# Altium schematic sheet signal_adaptation_block_Tine.SchDoc
size A4; SheetNumber: 4; SheetTotal: 4; SPICEModelCacheXXBIXYNA: <root> / <DocumentId>XXBIXYNA</DocumentId> / </root>
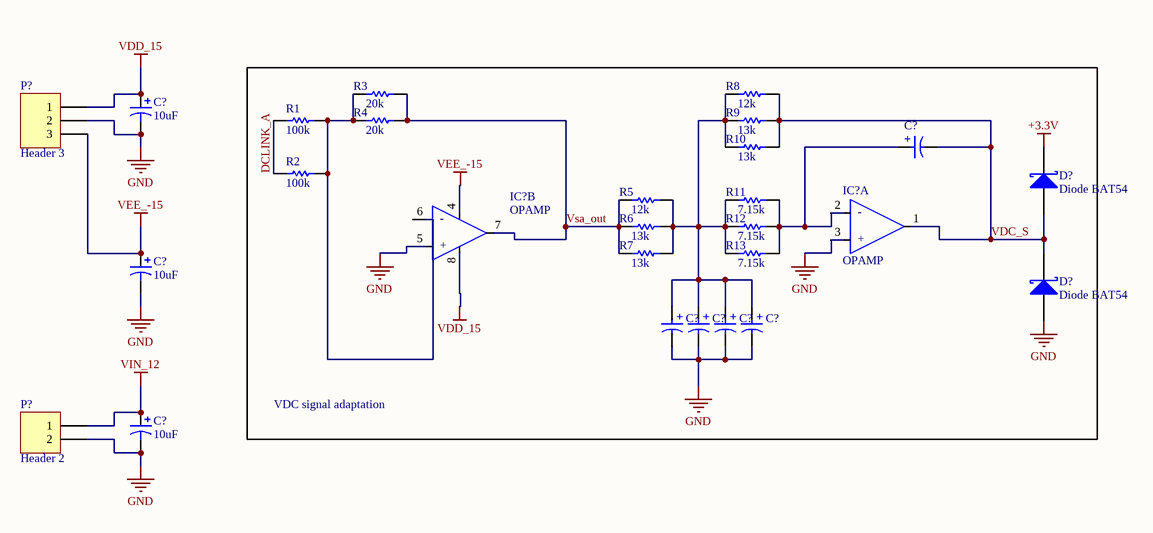
[diagram p0: signal_adaptation_block_Tine.SchDoc]

## Parts
(Parts that share a designator on the sheet are numbered #1, #2 ... from top to bottom, then left to right.)
C?#1  value 10uF  [RAD-0.2]  (hidden comment: Cap Pol1)
C?#2  860020772005  [WCAP-ATG5_D5H11]  (value not drawn)
C?#3  value 10uF  [RAD-0.2]  (hidden comment: Cap Pol1)
C?#4  860020772005  [WCAP-ATG5_D5H11]  (value not drawn)
C?#5  860020772005  [WCAP-ATG5_D5H11]  (value not drawn)
C?#6  860020772005  [WCAP-ATG5_D5H11]  (value not drawn)
C?#7  860020772005  [WCAP-ATG5_D5H11]  (value not drawn)
C?#8  value 10uF  [RAD-0.2]  (hidden comment: Cap Pol1)
D?#1  Diode BAT54  [DO-204AL]
D?#2  Diode BAT54  [DO-204AL]
IC?#1  OPAMP  [DIP-8]  (part A of 2)
IC?#2  OPAMP  [DIP-8]  (part B of 2)
P?#1  Header 3  [HDR1X3]
P?#2  Header 2  [HDR1X2]
R1  value 100k  [AXIAL-0.4]
R2  value 100k  [AXIAL-0.4]  (hidden comment: Res1)
R3  value 20k  [AXIAL-0.4]  (hidden comment: Res1)
R4  value 20k  [AXIAL-0.4]  (hidden comment: Res1)
R5  value 12k  [AXIAL-0.4]  (hidden comment: Res1)
R6  value 13k  [AXIAL-0.4]  (hidden comment: Res1)
R7  value 13k  [AXIAL-0.4]  (hidden comment: Res1)
R8  value 12k  [AXIAL-0.4]  (hidden comment: Res1)
R9  value 13k  [AXIAL-0.4]  (hidden comment: Res1)
R10  value 13k  [AXIAL-0.4]  (hidden comment: Res1)
R11  value 7.15k  [AXIAL-0.4]  (hidden comment: Res1)
R12  value 7.15k  [AXIAL-0.4]  (hidden comment: Res1)
R13  value 7.15k  [AXIAL-0.4]  (hidden comment: Res1)

## Blocks framed on the sheet
VDC signal adaptation: C?#2 C?#4-C?#7 D?#1 D?#2 IC?#1 IC?#2 R1-R13

## Nets
+3.3V: D?#1.2(K)
GND: C?#1.2 C?#3.2 C?#4.2(N) C?#5.2(N) C?#6.2(N) C?#7.2(N) C?#8.2 D?#2.1(A) IC?#1.3(IN_A_+) IC?#2.5(IN_B_+) P?#1.2 P?#2.2
VDD_15: C?#1.1 IC?#2.8(V+) P?#1.1
VEE_-15: C?#3.1 IC?#2.4(-V) P?#1.3
VIN_12: C?#8.1 P?#2.1
DCLINK_A: R1.1 R2.1
VDC_S: C?#2.2(N) D?#1.1(A) D?#2.2(K) IC?#1.1(OUT_A) R8.2 R9.2 R10.2
Vsa_out: IC?#2.7(OUT_B) R3.2 R4.2 R5.1 R6.1 R7.1
NetC?#2_1: C?#2.1(P) IC?#1.2(IN_A_-) R11.2 R12.2 R13.2
NetC?#4_1: C?#4.1(P) C?#5.1(P) C?#6.1(P) C?#7.1(P) R5.2 R6.2 R7.2 R8.1 R9.1 R10.1 R11.1 R12.1 R13.1
NetIC?#2_6: IC?#2.6(IN_B_-) R1.2 R2.2 R3.1 R4.1

## Notes on the sheet
- (in symbol ADTL082, part A) -; +
- (in symbol ADTL082, part B) -; +
- (in symbol CMP-03913-53914248-1) +

## Library data of the parts
C?#1 C?#3 C?#8 = Cap Pol1: Polarized Capacitor (Radial); Published: 8-Jun-2000; LatestRevisionDate: 17-Jul-2002; LatestRevisionNote: Re-released for DXP Platform.; PackageReference: RB7.6-15; Publisher: Altium Limited; PackageDescription: Polarized Capacitor (Radial); 2 Leads
C?#2 C?#4-C?#7 = CMP-03913-53914248-1: 860020772005 Cap Aluminum Lytic 1uF 63V 20% (5 X 11mm) Radial 2mm 13mA 2000h 105C; Life (Hours): 2000hours; Capacitance: 1µF; Material: Aluminium; Leakage Current: 3µA; Polarity: Polar; Voltage Rating: 63V; Tolerance: 20%; REACH SVHC: Unknown; Case/Package: Radial; NexarPartId: 53914248; Length: 11mm; Packaging: Tape & Box (TB); Pitch: 2mm; Ripple Current: 13mA; Height: 11mm; Height - Seated (Max): 12.4968mm; Max Operating Temperature: 105°C; Mount: Through Hole; Diameter: 5mm; RoHS: Compliant; Voltage Rating (DC): 63V; Lead Pitch: 2.0066mm; Min Operating Temperature: -40°C
D?#1 D?#2 = Diode 11DQ03: Schottky Rectifier; Published: 8-Jun-2000; LatestRevisionDate: 17-Jul-2002; LatestRevisionNote: Re-released for DXP Platform.; DatasheetVersion: Dec-1997; PackageReference: DO-204AL; Publisher: Altium Limited; PackageDescription: Diode, Axial; Body 5.2 x 2.7 mm (LxDia. max), Lead Dia. 0.86 mm (max); Code_JEDEC: DO-204-AL; ComponentLink1Description: Manufacturer Link; ComponentLink1URL: http://www.irf.com/; ComponentLink2Description: Datasheet; ComponentLink2URL: http://www.irf.com/product-info/datasheets/data/11dq03.pdf
IC?#1 IC?#2 = ADTL082
P?#1 = Header 3: Header, 3-Pin; LatestRevisionDate: 17-Jul-2002; LatestRevisionNote: Re-released for DXP Platform.; Publisher: Altium Limited
P?#2 = Header 2: Header, 2-Pin; LatestRevisionDate: 17-Jul-2002; LatestRevisionNote: Re-released for DXP Platform.; Publisher: Altium Limited
R1-R13 = Res1: Resistor; Published: 8-Jun-2000; LatestRevisionDate: 17-Jul-2002; LatestRevisionNote: Re-released for DXP Platform.; PackageReference: AXIAL-0.3; Publisher: Altium Limited; PackageDescription: Axial Device, Thru-Hole; 2 Leads; 0.3 in Pin Spacing